# Altium schematic sheet PT100.SchDoc
size A4; SheetNumber: 1; SheetTotal: 16
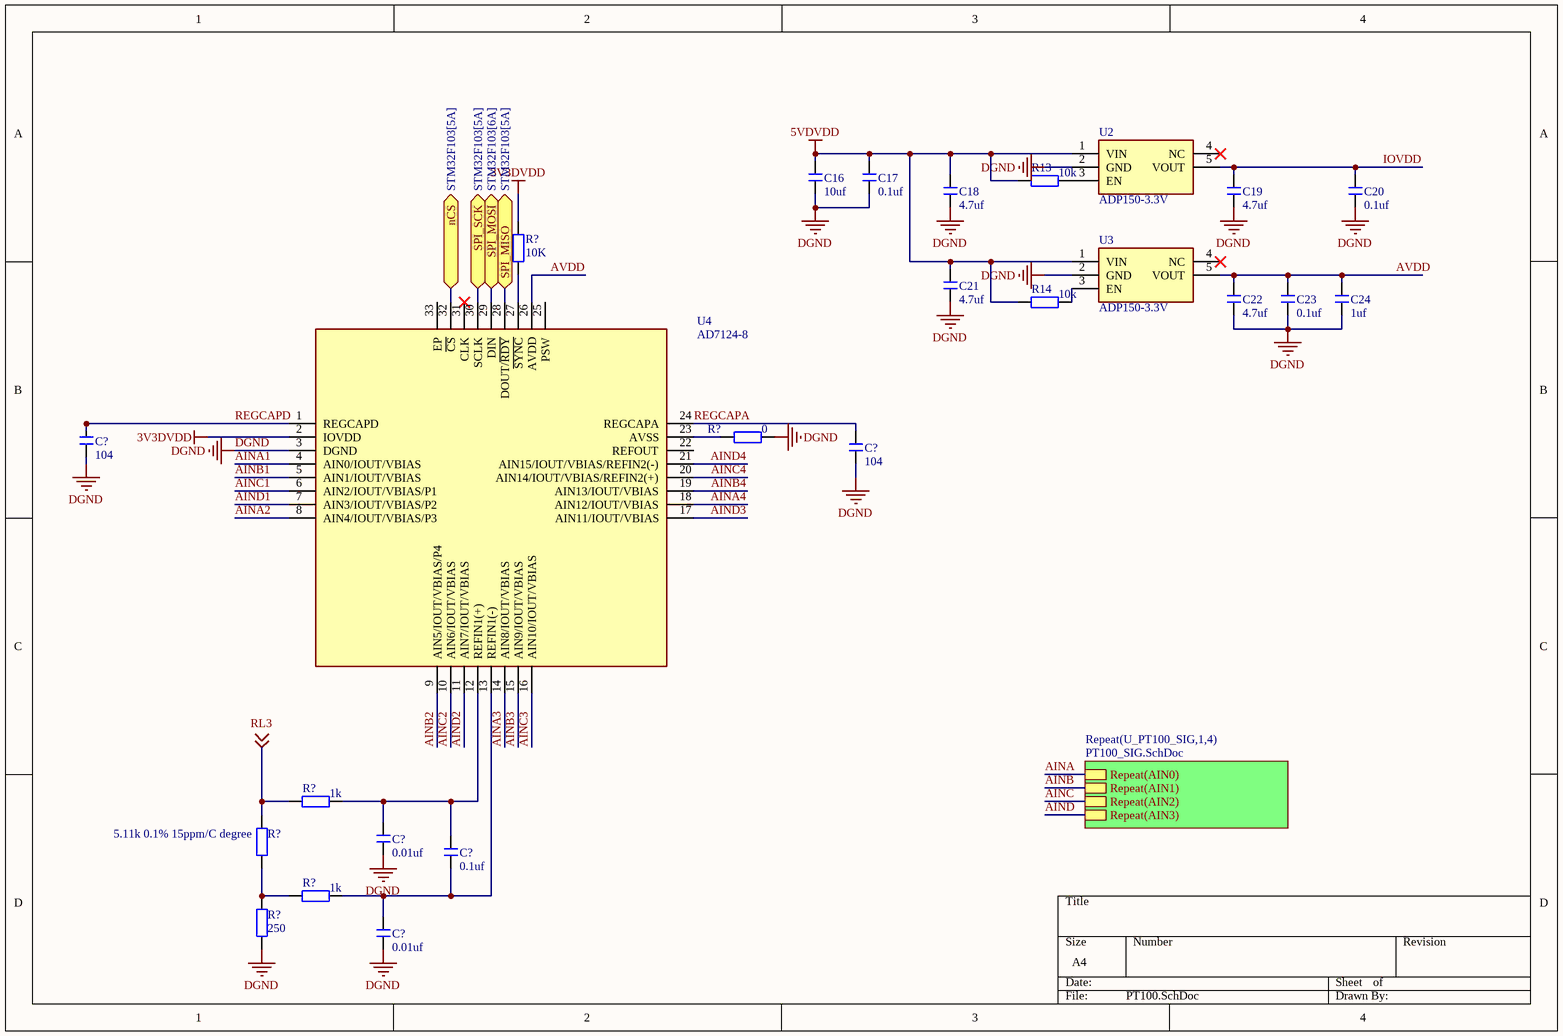
[diagram p0: PT100.SchDoc]

## Parts
(Parts that share a designator on the sheet are numbered #1, #2 ... from top to bottom, then left to right.)
C16  10uf  [C 0603_L]
C17  0.1uf  [C 0603_L]
C18  4.7uf  [C 0603_L]
C19  4.7uf  [C 0603_L]
C20  0.1uf  [C 0603_L]
C21  4.7uf  [C 0603_L]
C22  4.7uf  [C 0603_L]
C23  0.1uf  [C 0603_L]
C24  1uf  [C 0603_L]
C?#1  104  [C 0603_L]
C?#2  104  [C 0603_L]
C?#3  0.01uf  [C 0603_L]
C?#4  0.1uf  [C 0603_L]
C?#5  0.01uf  [C 0603_L]
R13  10k  [R 0603_L]
R14  10k  [R 0603_L]
R?#1  10K  [R 0603_L]
R?#2  0  [R 0603_L]
R?#3  1k  [R 0603_L]
R?#4  5.11k 0.1% 15ppm/C degree  [R 0603_L]
R?#5  1k  [R 0603_L]
R?#6  250  [R 0603_L]
U2  ADP150-3.3V
U3  ADP150-3.3V
U4  AD7124-8

## Sub-sheets
Repeat(U_PT100_SIG,1,4) = PT100_SIG.SchDoc: Repeat(AIN0), Repeat(AIN1), Repeat(AIN2), Repeat(AIN3)

## Ports
nCS (bidir, see STM32F103[5A]), SPI_MISO (bidir, see STM32F103[5A]), SPI_MOSI (bidir, see STM32F103[6A]), SPI_SCK (bidir, see STM32F103[5A])

## Nets
3V3DVDD: R?#1.1 U4.2(IOVDD)
5VDVDD: C16.2 C17.2 C18.2 C21.2 R13.1 R14.1 U2.1(VIN) U3.1(VIN)
DGND: C16.1 C17.1 C18.1 C19.1 C20.1 C21.1 C22.1 C23.1 C24.1 C?#1.2 C?#2.2 C?#3.1 C?#5.1 R?#2.2 R?#6.1 U2.2(GND) U3.2(GND) U4.3(DGND)
AINA: sheet Repeat(U_PT100_SIG,1,4)/Repeat(AIN0)
AINA1: U4.4(AIN0/IOUT/VBIAS)
AINA2: U4.8(AIN4/IOUT/VBIAS/P3)
AINA3: U4.14(AIN8/IOUT/VBIAS)
AINA4: U4.18(AIN12/IOUT/VBIAS)
AINB: sheet Repeat(U_PT100_SIG,1,4)/Repeat(AIN1)
AINB1: U4.5(AIN1/IOUT/VBIAS)
AINB2: U4.9(AIN5/IOUT/VBIAS/P4)
AINB3: U4.15(AIN9/IOUT/VBIAS)
AINB4: U4.19(AIN13/IOUT/VBIAS)
AINC: sheet Repeat(U_PT100_SIG,1,4)/Repeat(AIN2)
AINC1: U4.6(AIN2/IOUT/VBIAS/P1)
AINC2: U4.10(AIN6/IOUT/VBIAS)
AINC3: U4.16(AIN10/IOUT/VBIAS)
AINC4: U4.20(AIN14/IOUT/VBIAS/REFIN2(+))
AIND: sheet Repeat(U_PT100_SIG,1,4)/Repeat(AIN3)
AIND1: U4.7(AIN3/IOUT/VBIAS/P2)
AIND2: U4.11(AIN7/IOUT/VBIAS)
AIND3: U4.17(AIN11/IOUT/VBIAS)
AIND4: U4.21(AIN15/IOUT/VBIAS/REFIN2(-))
AVDD: C22.2 C23.2 C24.2 U3.5(VOUT) U4.26(AVDD)
IOVDD: C19.2 C20.2 U2.5(VOUT)
nCS: U4.32(~{CS}) ; port nCS
REGCAPA: C?#2.1 U4.24(REGCAPA)
REGCAPD: C?#1.1 U4.1(REGCAPD)
RL3: R?#3.1 R?#4.2 ; off-sheet RL3
SPI_MISO: U4.28(DOUT/~{RDY}) ; port SPI_MISO
SPI_MOSI: U4.29(DIN) ; port SPI_MOSI
SPI_SCK: U4.30(SCLK) ; port SPI_SCK
NetC?#3_2: C?#3.2 C?#4.2 R?#3.2 U4.12(REFIN1(+))
NetC?#4_1: C?#4.1 C?#5.2 R?#5.2 U4.13(REFIN1(-))
NetR13_2: R13.2 U2.3(EN)
NetR14_2: R14.2 U3.3(EN)
NetR?#1_2: R?#1.2 U4.27(~{SYNC})
NetR?#2_1: R?#2.1 U4.23(AVSS)
NetR?#4_1: R?#4.1 R?#5.1 R?#6.2

Not connected (* = marked no-connect by the designer): U2 4(NC)*; U3 4(NC)*; U4 22(REFOUT) 25(PSW) 31(CLK)* 33(EP)

## Library data of the parts
C16-C24 C?#3-C?#5 = C: 贴片电容
C?#1 C?#2 = C: 贴片电容; BOM名称: 无极性贴片电容
R13 R14 R?#3-R?#5 = 0805 电阻: 贴片电阻 0805 电阻; ComponentLink1Description: 供应商链接; ComponentLink1URL: http://www.szlcsc.com/product/details_18165.html; Package: 0805; Supplier: LC; SuppliersPartNumber: C17477
R?#1 R?#2 = R: 贴片电阻; BOM名称: 贴片电阻
R?#6 = 0805 电阻: Reference buffer Headroom 贴片电阻 0805 电阻; ComponentLink1Description: 供应商链接; ComponentLink1URL: http://www.szlcsc.com/product/details_18165.html; Package: 0805; Supplier: LC; SuppliersPartNumber: C17477
U2 = ADP150: IOVDD needs 1.8V
U3 = ADP150: ACDD needs 3.3V